# Altium schematic sheet Main.SchDoc
size A; SheetNumber: 1; SheetTotal: 5
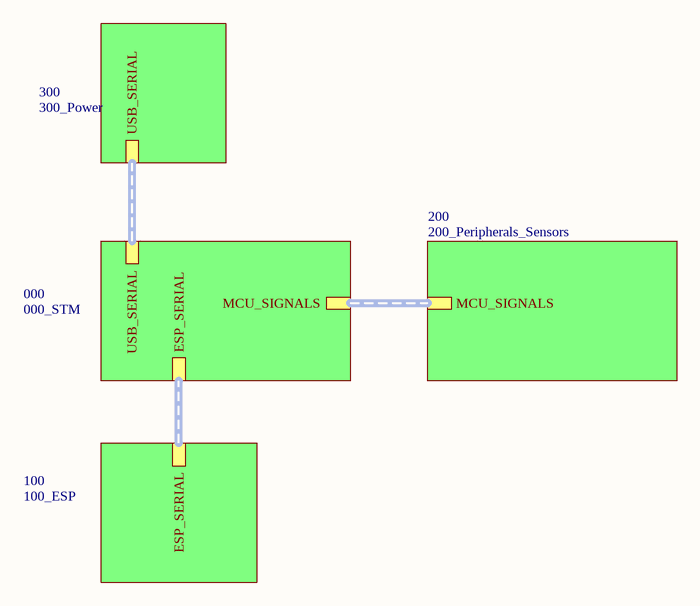
[diagram p0: Main.SchDoc]

## Sub-sheets
000 = 000_STM: MCU_SIGNALS (harness MCU_SIGNALS), USB_SERIAL (harness USB_SERIAL), ESP_SERIAL (harness ESP_SERIAL)
100 = 100_ESP: ESP_SERIAL (harness ESP_SERIAL)
200 = 200_Peripherals_Sensors: MCU_SIGNALS (harness MCU_SIGNALS)
300 = 300_Power: USB_SERIAL (harness USB_SERIAL)

## Buses and harness runs
harness sheet 000/ESP_SERIAL = sheet 100/ESP_SERIAL
harness sheet 000/MCU_SIGNALS = sheet 200/MCU_SIGNALS
harness sheet 000/USB_SERIAL = sheet 300/USB_SERIAL